# Altium schematic sheet Sheet1.SchDoc: Embeed Image Sensor
size A4; CheckedBy: Zengzishuai; Author: Zengzishuai; CompanyName: HFUT
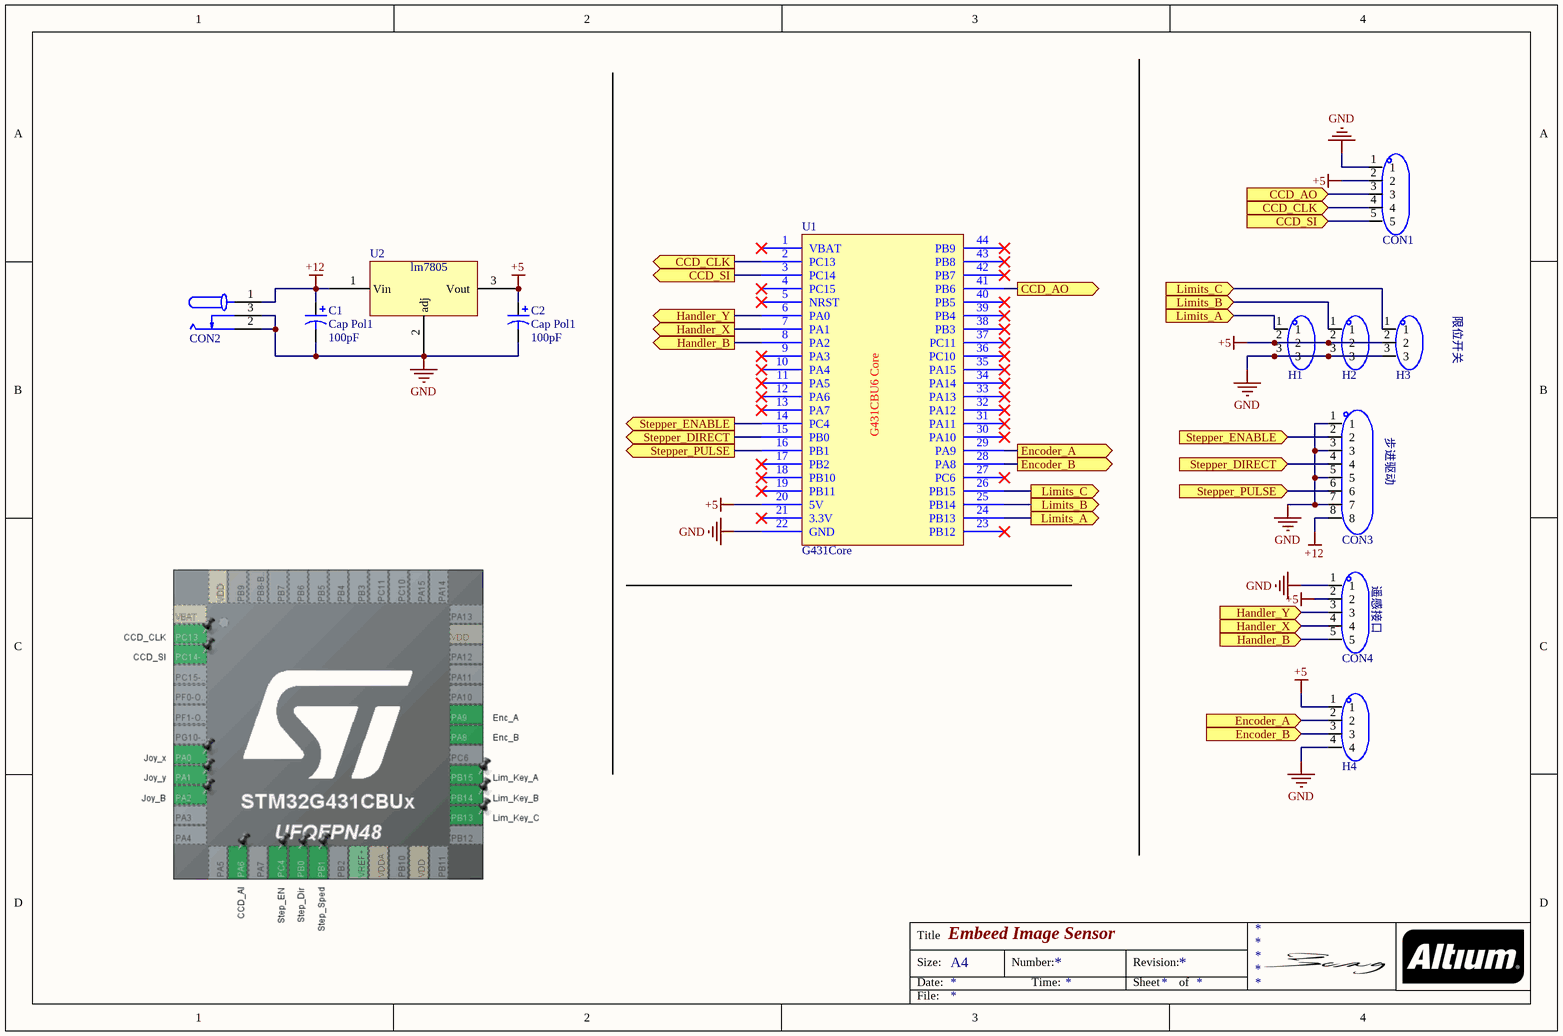
[diagram p0: Sheet1.SchDoc]

## Parts
C1  Cap Pol1  value 100pF  [RB7.6-15]
C2  Cap Pol1  value 100pF  [RB7.6-15]
CON1  XH2.54-5P  [CONN-TH_5P-P2.50_ZX-XH2.54-5PZZ]  (value not drawn)
CON2  DC_Power_Connector  [DC-IN-TH_DC-005-5A-2.0]  (value not drawn)
CON3  8Pin_Screw  [CONN-TH_8P-P3.81_WJ15EDGRC-3.81-8P]  (value not drawn)
CON4  PH2.0_5Pin  [CONN-TH_5P-P2.00-PH5A]  (value not drawn)
H1  3Pin_Connector  [HDR-TH_3P-P2.54-V-M]  (value not drawn)
H2  3Pin_Connector  [HDR-TH_3P-P2.54-V-M]  (value not drawn)
H3  3Pin_Connector  [HDR-TH_3P-P2.54-V-M]  (value not drawn)
H4  2.54_4Pin  [HDR-TH_4P-P2.54-V-M]  (value not drawn)
U1  G431Core  [PCBComponent_1]
U2  lm7805  [TO-220-3_L10.0-W4.5-P2.54-L]

## Ports
CCD_AO (in), CCD_AO (out), CCD_CLK (in), CCD_CLK (out), CCD_SI (in), CCD_SI (out), Encoder_A (in), Encoder_A (out), Encoder_B (in), Encoder_B (out), Handler_B (in), Handler_B (out), Handler_X (in), Handler_X (out), Handler_Y (in), Handler_Y (out), Limits_A (in), Limits_A (out), Limits_B (in), Limits_B (out), Limits_C (in), Limits_C (out), Stepper_DIRECT (in), Stepper_DIRECT (out), Stepper_ENABLE (in), Stepper_ENABLE (out), Stepper_PULSE (in), Stepper_PULSE (out)

## Nets
+5: C2.1 CON1.2 CON4.2 H1.2 H2.2 H3.2 H4.1 U1.20(5V) U2.3(Vout)
+12: C1.1 CON2.1 CON3.8 U2.1(Vin)
GND: C1.2 C2.2 CON1.1 CON2.2 CON2.3 CON3.1 CON3.3 CON3.5 CON3.7 CON4.1 H1.3 H2.3 H3.3 H4.4 U1.22(GND) U2.2(adj)
CCD_AO: CON1.3 U1.41(PB6) ; port CCD_AO
CCD_CLK: CON1.4 U1.2(PC13) ; port CCD_CLK
CCD_SI: CON1.5 U1.3(PC14) ; port CCD_SI
Encoder_A: H4.2 U1.29(PA9) ; port Encoder_A
Encoder_B: H4.3 U1.28(PA8) ; port Encoder_B
Handler_B: CON4.5 U1.8(PA2) ; port Handler_B
Handler_X: CON4.4 U1.7(PA1) ; port Handler_X
Handler_Y: CON4.3 U1.6(PA0) ; port Handler_Y
Limits_A: H1.1 U1.24(PB13) ; port Limits_A
Limits_B: H2.1 U1.25(PB14) ; port Limits_B
Limits_C: H3.1 U1.26(PB15) ; port Limits_C
Stepper_DIRECT: CON3.4 U1.15(PB0) ; port Stepper_DIRECT
Stepper_ENABLE: CON3.2 U1.14(PC4) ; port Stepper_ENABLE
Stepper_PULSE: CON3.6 U1.16(PB1) ; port Stepper_PULSE

Not connected (* = marked no-connect by the designer): U1 1(VBAT)* 4(PC15)* 5(NRST)* 9(PA3)* 10(PA4)* 11(PA5)* 12(PA6)* 13(PA7)* 17(PB2)* 18(PB10)* 19(PB11)* 21(3.3V)* 23(PB12)* 27(PC6)* 30(PA10)* 31(PA11)* 32(PA12)* 33(PA13)* 34(PA14)* 35(PA15)* 36(PC10)* 37(PC11)* 38(PB3)* 39(PB4)* 40(PB5)* 42(PB7)* 43(PB8)* 44(PB9)*

## Notes on the sheet
- 限位开关
- (near CON3) 步进驱动
- (near CON4) 遥感接口
- Title
- Size:
- Date:
- A4
- Number:
- Time:
- Revision:
- Sheet
- of
- File:
- (in symbol G431Core) G431CBU6 Core

## Library data of the parts
C1 C2 = Cap Pol1: Polarized Capacitor (Radial); Published: 8-Jun-2000; LatestRevisionDate: 17-Jul-2002; LatestRevisionNote: Re-released for DXP Platform.; PackageReference: RB7.6-15; Publisher: Altium Limited; PackageDescription: Polarized Capacitor (Radial); 2 Leads
CON1 = XH2.54-5P: Manufacturer: Megastar(兆星); Symbol: ZX-XH2.54-5PZZ; Add into BOM: yes; Pins Structure: 1x5P; Pitch: 2.54mm; Reference Series: XH; Number of PINs Per Row: 5; Current Rating (Max): 3A; Device: ZX-XH2.54-5PZZ; LCSC Part Name: ZX-XH2.54-5PZZ; Supplier Part: C7429635; Manufacturer Part: ZX-XH2.54-5PZZ; Supplier Footprint: 插件,P=2.54mm; JLCPCB Part Class: 扩展库; Datasheet: https://atta.szlcsc.com/upload/public/pdf/source/20230619/60EEF4ADD558E90BFFACF5D939816781.pdf; Supplier: LCSC; Convert to PCB: yes; Mounting Style: 直插; Number of Pins: 5P; Number of Rows: 1; Row Spacing: -; Contact Material: 黄铜; Contact Plating: 锡; Operating Temperature Range: -25℃~+85℃
CON2 = DC_Power_Connector: Manufacturer: XKB Connection(中国星坤); Symbol: DC-005-5A-2.0; Add into BOM: yes; Connector Type: DC电源插座; Inside Contact Diameter: 2mm; Outside Contact Diameter: 6.2mm; Current Rating (Max): 5A; Voltage Rating (Max): 24V; Device: DC-005-5A-2.0; LCSC Part Name: DC电源插座 内径:2mm 外径:6.2mm; Supplier Part: C381116; Manufacturer Part: DC-005-5A-2.0; Supplier Footprint: 插件; JLCPCB Part Class: 扩展库; Datasheet: https://atta.szlcsc.com/upload/public/pdf/source/20211015/707A35F7AB6E89C57AAB641950105BB7.pdf; Supplier: LCSC; Convert to PCB: yes; Mounting Style: 弯插; Operating Temperature Range: -20℃~+70℃
CON3 = 8Pin_Screw: Manufacturer: KANGNEX(康奈克斯电气); Symbol: WJ15EDGRC-3.81-8P; Add into BOM: yes; Connector Type: 板端/插座-闭口; Structure: 1x8P; Pitch: 3.81mm; Number of PINs Per Row: 8; Current Rating (Max): 8A; Voltage Rating (Max): 300V; Device: WJ15EDGRC-3.81-8P; LCSC Part Name: 1x8P 3.81mm 排数:1 每排P数:8; Supplier Part: C14235; Manufacturer Part: WJ15EDGRC-3.81-8P; Supplier Footprint: 弯插,P=3.81mm; JLCPCB Part Class: 扩展库; Datasheet: https://atta.szlcsc.com/upload/public/pdf/source/20191225/C14235_C8BDA83BBDBD01ECF9C88040C6983038.pdf; Supplier: LCSC; Convert to PCB: yes; fixed form: -; Color: -; Mounting Style: 弯针; Number of Pins: 8P; Number of Rows: 1; Wire Gauge - AWG: -; Wire Gauge - mm2: -; Contact Material: 黄铜; Contact Plating: 锡; Operating Temperature Range: -40℃~+105℃; Soldering Temperature(Max): -; Connection Type: -; Outlet Direction (Vertical Basis): -
CON4 = PH2.0_5Pin: Manufacturer: XUNPU(讯普); Symbol: WAFER-PH2.0-5PZZ; Add into BOM: yes; Pins Structure: 1x5P; Pitch: 2mm; Reference Series: PH; Number of PINs Per Row: 5; Current Rating (Max): 2A; Device: WAFER-PH2.0-5PZZ; LCSC Part Name: PH 2.0mm 1x5P 直插; Supplier Part: C5359602; Manufacturer Part: WAFER-PH2.0-5PZZ; Supplier Footprint: 插件,P=2mm; JLCPCB Part Class: 扩展库; Supplier: LCSC; Convert to PCB: yes; Mounting Style: 直插; Number of Pins: 5P; Number of Rows: 1; Operating Temperature Range: -25℃~+85℃
H1-H3 = 3Pin_Connector: Manufacturer: XFCN(兴飞); Symbol: PZ254V-11-03P_C2937625; Device: PZ254V-11-03P; Add into BOM: yes; Pin Structure: 1x3P; Pitch: 2.54mm; Circluar Pins/Square Pins: 方针; Current Rating (Max): 3A; Voltage Rating (Max): 250V; LCSC Part Name: 间距:2.54mm 1x3P 直插 方针; Supplier Part: C2937625; Manufacturer Part: PZ254V-11-03P; Supplier Footprint: 插件,P=2.54mm; JLCPCB Part Class: 扩展库; Datasheet: https://atta.szlcsc.com/upload/public/pdf/source/20200309/C492402_8335C3D49C4E4C618838D59BB1D024C1.pdf; Supplier: LCSC; Convert to PCB: yes; Row Spacing: -; Mounting Type: 直插; Number of Rows: 单排; Number of Pins: 3P; Length of Mating Pin: 6mm; Insulation Height: 2.5mm; Length of End Connection Pin: 3mm; Operating Temperature Range: -40℃~+105℃; Color: 黑色
H4 = 2.54_4Pin: Manufacturer: XFCN(兴飞); Symbol: PZ254V-11-04P_C2691448; Device: PZ254V-11-04P; Add into BOM: yes; Pin Structure: 1x4P; Pitch: 2.54mm; Circluar Pins/Square Pins: 方针; Current Rating (Max): 3A; Voltage Rating (Max): 250V; LCSC Part Name: 间距:2.54mm 1x4P 直插 方针; Supplier Part: C2691448; Manufacturer Part: PZ254V-11-04P; Supplier Footprint: 插件,P=2.54mm; JLCPCB Part Class: 扩展库; Datasheet: https://atta.szlcsc.com/upload/public/pdf/source/20200309/C492403_F9F19131791D08044AD4F84F8E751A34.pdf; Supplier: LCSC; Convert to PCB: yes; Row Spacing: -; Mounting Type: 直插; Number of Rows: 单排; Number of Pins: 4P; Length of Mating Pin: 6mm; Insulation Height: 2.5mm; Length of End Connection Pin: 3mm; Contact Material: -; Operating Temperature Range: -40℃~+105℃; Color: 黑色